# Altium schematic sheet dc_dc_converters.SchDoc
size A; SheetNumber: 3; SheetTotal: 3
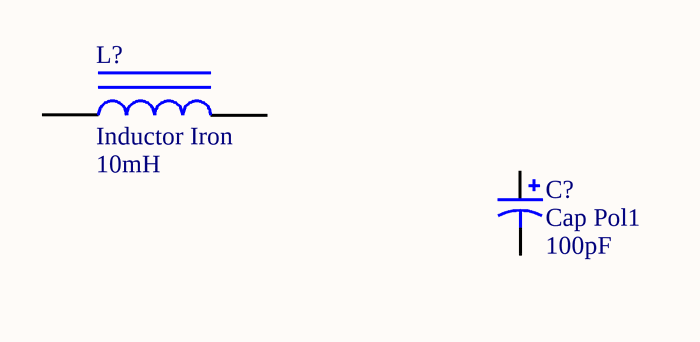
[diagram p0: dc_dc_converters.SchDoc]

## Parts
C?  Cap Pol1  value 100pF  [RB7.6-15]
L?  Inductor Iron  value 10mH  [AXIAL-0.9]

## Nets

Not connected (* = marked no-connect by the designer): C? 1 2; L? 1 2

## Library data of the parts
C? = Cap Pol1: Polarized Capacitor (Radial); Published: 8-Jun-2000; LatestRevisionDate: 17-Jul-2002; LatestRevisionNote: Re-released for DXP Platform.; PackageReference: RB7.6-15; Publisher: Altium Limited; PackageDescription: Polarized Capacitor (Radial); 2 Leads
L? = Inductor Iron: Magnetic-Core Inductor; Published: 24-Mar-1999; LatestRevisionDate: 17-Jul-2002; LatestRevisionNote: Re-released for DXP Platform.; PackageReference: AXIAL-0.9; Publisher: Altium Limited; PackageDescription: Axial Device, Thru-Hole; 2 Leads; 0.9 in Pin Spacing